# Altium schematic sheet AC_to_HighDC.SchDoc
size A4
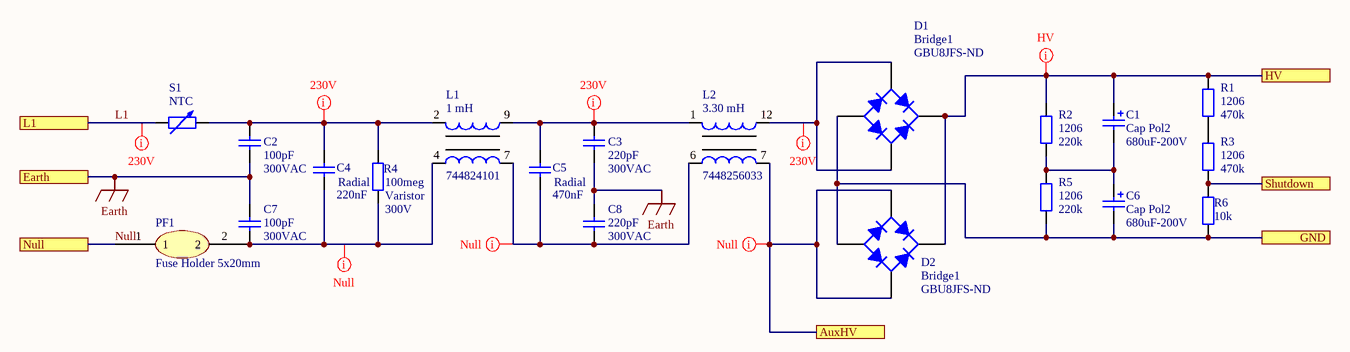
[diagram p0: AC_to_HighDC.SchDoc]

## Parts
C1  Cap Pol2  value 680uF-200V  [Capacitor]
C2  value 100pF  MaxVoltage: 300VAC  [Film Capacitor]  (hidden comment: Cap)
C3  value 220pF  MaxVoltage: 300VAC  [Film Capacitor]  (hidden comment: Cap)
C4  value 220nF  Style: Radial  [Film Capacitor]  (hidden comment: Cap)
C5  value 470nF  Style: Radial  [Film Capacitor]  (hidden comment: Cap)
C6  Cap Pol2  value 680uF-200V  [Capacitor]
C7  value 100pF  MaxVoltage: 300VAC  [Film Capacitor]  (hidden comment: Cap)
C8  value 220pF  MaxVoltage: 300VAC  [Film Capacitor]  (hidden comment: Cap)
D1  Bridge1  Supplier Part Number 1: GBU8JFS-ND  [BridgeRectif]
D2  Bridge1  Supplier Part Number 1: GBU8JFS-ND  [BridgeRectif]
L1  744824101  Inductance: 1 mH  [WE-CMB-L]
L2  7448256033  Inductance: 3.30 mH  [WE-CMB-XL]
PF1  Fuse Holder 5x20mm  [FuseHolder]
R1  1206  value 470k  [C1206]
R2  1206  value 220k  [C1206]
R3  1206  value 470k  [C1206]
R4  300V  value 100meg  [Varistor]
R5  1206  value 220k  [C1206]
R6  value 10k  [6-0805_N]  (hidden comment: Res2)
S1  NTC  [NTC]

## Ports
AuxHV, Earth, GND, HV, L1, Null, Shutdown

## Nets
Earth: C2.1 C3.1 C7.2 C8.2 ; port Earth
AuxHV: D2.2(C) D2.3(C) L2.7 ; port AuxHV
GND: C6.2 D1.4(A) D2.4(A) R5.1 R6.1 ; port GND
HV: C1.1 D1.1(K) D2.1(K) R1.2 R2.2 ; port HV
L1: S1.1 ; port L1
Null: PF1.1 ; port Null
Shutdown: R3.1 R6.2 ; port Shutdown
NetC1_2: C1.2 C6.1 R2.1 R5.2
NetC2_2: C2.2 C4.2 L1.2 R4.2 S1.2
NetC3_2: C3.2 C5.2 L1.9 L2.1
NetC4_1: C4.1 C7.1 L1.4 PF1.2 R4.1
NetC5_1: C5.1 C8.1 L1.7 L2.6
NetD1_2: D1.2(C) D1.3(C) L2.12
NetR1_1: R1.1 R3.2

## Layout directives
mark named 230V: L1, NetC2_2, NetC3_2, NetD1_2
mark named Null: AuxHV, NetC4_1, NetC5_1
mark named HV: HV

## Library data of the parts
C1 C6 = Cap Pol2: Polarized Capacitor (Axial); Published: 8-Jun-2000; LatestRevisionDate: 17-Jul-2002; LatestRevisionNote: Re-released for DXP Platform.; PackageReference: POLAR0.8; Publisher: Altium Limited; PackageDescription: Polarized Capacitor; 2 Leads; Supplier 1: Digi-Key; Supplier Part Number 1: 493-2703-ND
C2-C5 C7 C8 = Cap: Capacitor; Published: 8-Jun-2000; LatestRevisionDate: 17-Jul-2002; LatestRevisionNote: Re-released for DXP Platform.; PackageReference: RAD-0.3; Publisher: Altium Limited; PackageDescription: Radial Cap, Thru-Hole; 2 Leads; 0.3 in Pin Spacing; Supplier 1: Digi-Key
  C2 C3 C7 C8: Supplier Part Number 1: 490-9469-ND
  C4 C5: Supplier Part Number 1: ECQ-U2A224KL-ND
D1 D2 = Bridge1: Full Wave Diode Bridge; Published: 8-Jun-2000; LatestRevisionDate: 29-May-2009; LatestRevisionNote: Sch pins A & K swapped.; DatasheetVersion: E2732B; PackageReference: D-38; Publisher: Altium Limited; PackageDescription: Bridge Rectifier; 4 Terminals; Body 9.4 x 9.4 mm (typ); Pitch 5.08 mm; Supplier 1: Digi-Key
L1 = 744824101: THT Common Mode Power Line Choke WE-CMB, L = 1.00 mH; ComponentLink1Description: Manufacturer Link; ComponentLink2Description: Datasheet; DatasheetVersion: ver 5, Oct-2004; ComponentLink1URL: http://www.we-online.com; PackageVersion: 2004; PackageDescription: THT Inductor, 4-Leads, Body 27.5 x 18.5 mm; ComponentLink2URL: http://www.we-online.de/katalog/media/pdf/744824101.pdf; PackageReference: WE-CMB-L; PartNumber: 744824101; Supplier 1: Mouser; Supplier Part Number 1: 710-744824101
L2 = 7448256033: THT Common Mode Power Line Choke WE-CMB, L = 3.30 mH; ComponentLink1Description: Manufacturer Link; ComponentLink2Description: Datasheet; DatasheetVersion: ver 4, Oct-2004; ComponentLink1URL: http://www.we-online.com; PackageVersion: 2004; PackageDescription: THT Inductor, 4-Leads, Body 30.0 x 21.0 mm; ComponentLink2URL: http://www.we-online.de/katalog/media/pdf/7448256033.pdf; PackageReference: WE-CMB-XL; PartNumber: 7448256033
PF1 = Fuse Holder
R1-R6 = Res2: Resistor; Published: 8-Jun-2000; LatestRevisionDate: 17-Jul-2002; LatestRevisionNote: Re-released for DXP Platform.; PackageReference: AXIAL-0.4; Publisher: Altium Limited; PackageDescription: Axial Device, Thru-Hole; 2 Leads; 0.4 in Pin Spacing
  R1-R3 R5: Supplier 1: Digi-Key; Supplier Part Number 1: 541-220KFDKR-ND
  R4: Type: Varistor
  R6: Supplier 1: Digi-Key; Supplier Part Number 1: 490-2436-1-ND
S1 = Res Adj2: InrushProtection; Value: 2; Set Position: 0.5; Published: 8-Jun-2000; LatestRevisionDate: 17-Jul-2002; LatestRevisionNote: Re-released for DXP Platform.; PackageReference: AXIAL-0.6; Publisher: Altium Limited; PackageDescription: Axial Device, Thru-Hole; 2 Leads; 0.6 in Pin Spacing; Supplier 1: Digi-Key